# EAGLE design MediumWaveRadioTransmitter (EAGLE 9.6.2)
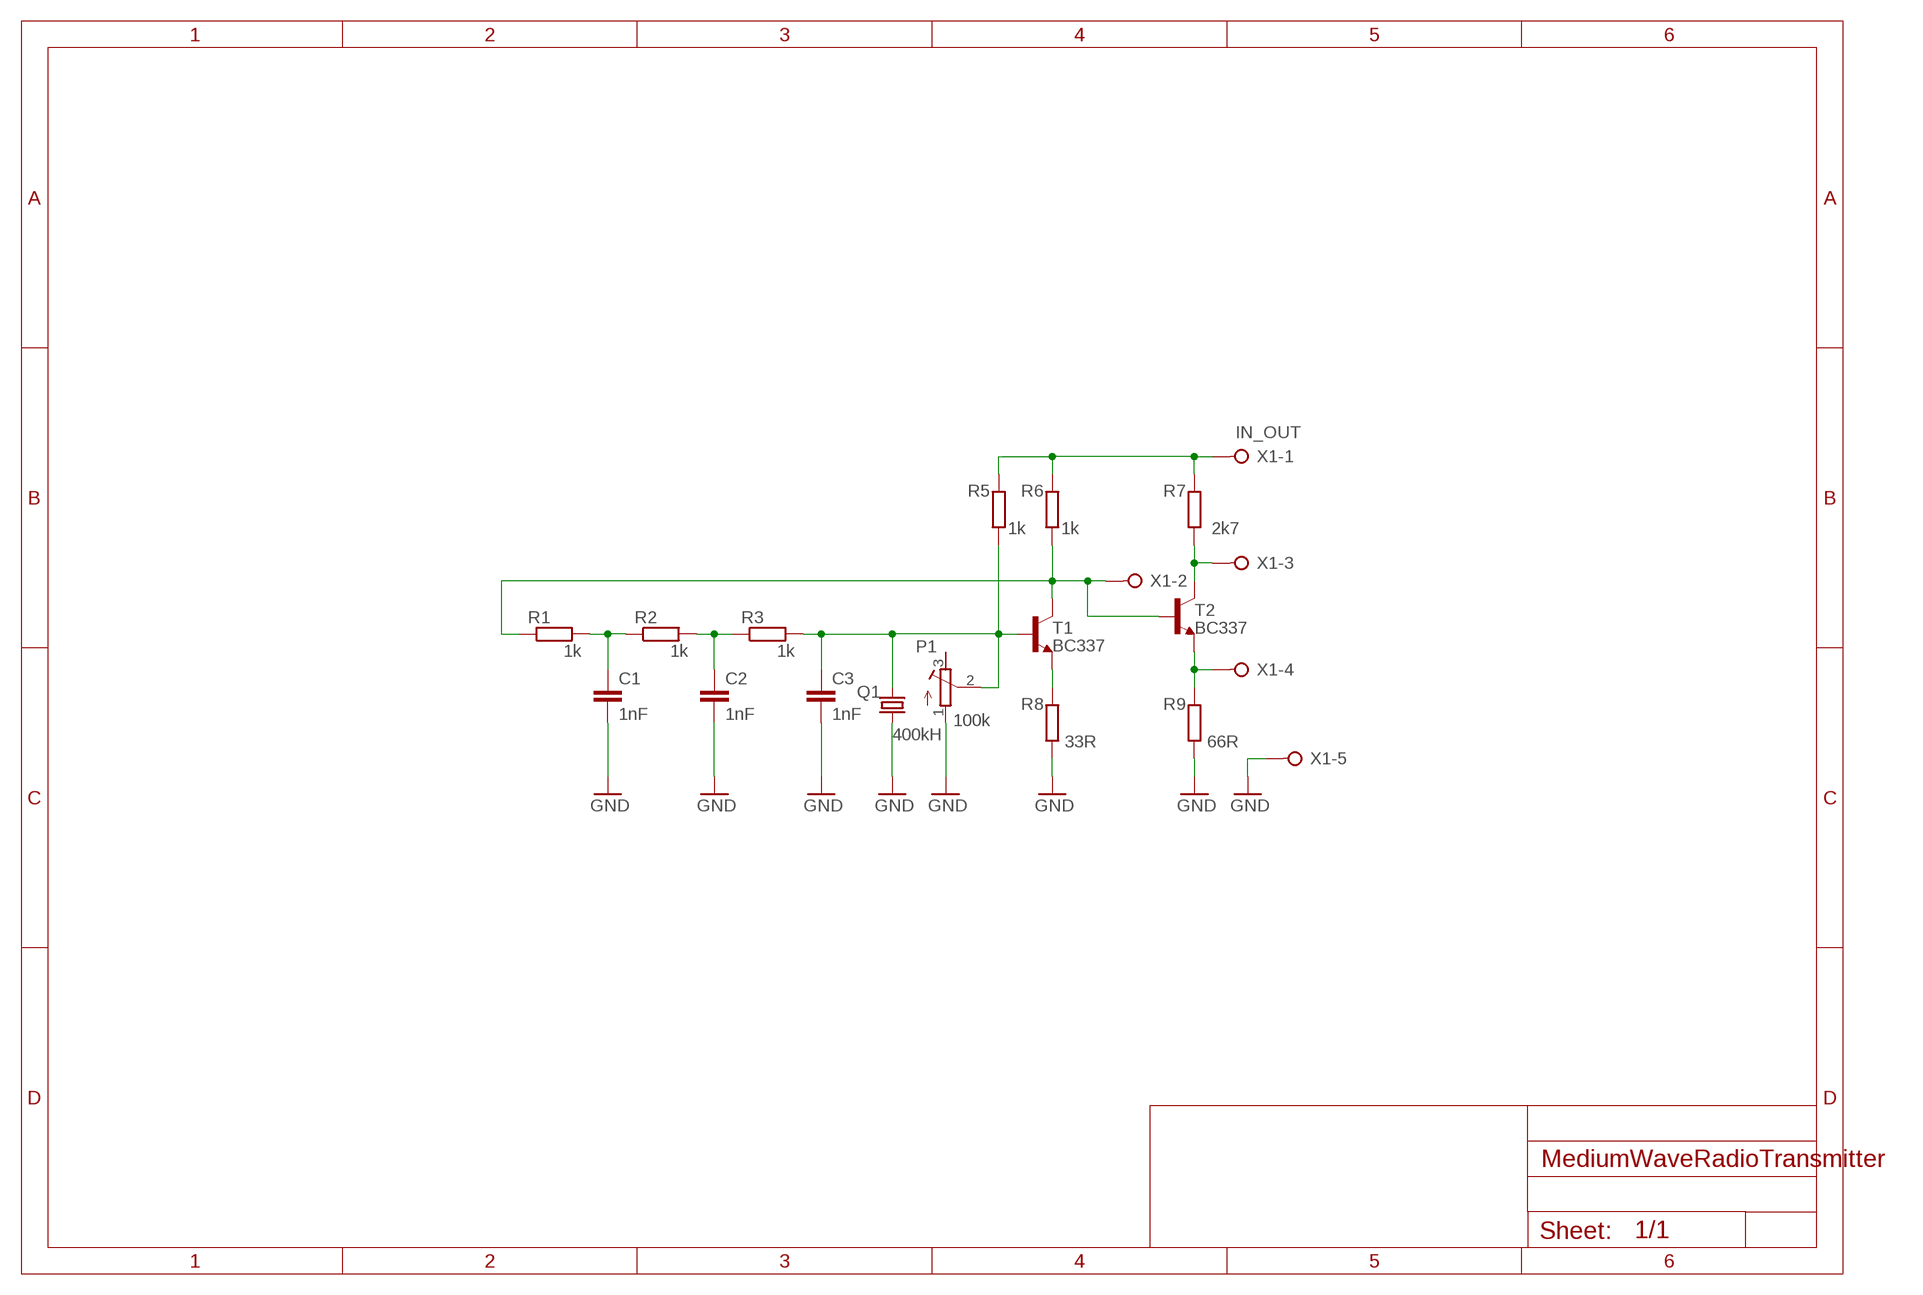
[diagram p0: schematic, sheet 1]

## Parts
C1  1nF  C-EU050-024X044  [C050-024X044]
C2  1nF  C-EU050-024X044  [C050-024X044]
C3  1nF  C-EU050-024X044  [C050-024X044]
P1  100k  R-TRIMM3296W  [RTRIM3296W]
Q1  400kH  CRYSTALHC18U-V  [HC18U-V]
R1  1k  R-EU_0207/10  [0207/10]
R2  1k  R-EU_0207/10  [0207/10]
R3  1k  R-EU_0207/10  [0207/10]
R5  1k  R-EU_0207/10  [0207/10]
R6  1k  R-EU_0207/10  [0207/10]
R7  2k7  R-EU_0207/10  [0207/10]
R8  33R  R-EU_0207/10  [0207/10]
R9  66R  R-EU_0207/10  [0207/10]
T1  BC337  BC337-16-NPN-TO92-CBE  [TO92-CBE]
T2  BC337  BC337-16-NPN-TO92-CBE  [TO92-CBE]
X1  IN_OUT  W237-05P  [W237-5P]

## Nets
GND: C1.2 C2.2 C3.2 P1.1(A) Q1.2 R8.1 R9.1 X1.5
N$1: C1.1 R1.2 R2.1
N$2: C2.1 R2.2 R3.1
N$3: C3.1 P1.2(S) Q1.1 R3.2 R5.1 T1.B
N$5: R1.1 R6.1 T1.C T2.B X1.2
N$6: R8.2 T1.E
N$7: R5.2 R6.2 R7.2 X1.1
N$8: R9.2 T2.E X1.4
N$10: R7.1 T2.C X1.3
Unconnected: P1.3(E)

## Library data of the parts
C1-C3 = rcl:C-EU: CAPACITOR, European symbol; SPICEPREFIX: C
P1 = rcl:R-TRIMM: Trimm resistor; SPICEMODEL: X; SPICEPREFIXL: POT
Q1 = crystal:CRYSTAL: CRYSTAL; OC_FARNELL: unknown; OC_NEWARK: unknown
R1-R3 R5-R9 = rcl:R-EU_: RESISTOR, European symbol; SPICEPREFIX: R
T1 T2 = transistor:*-NPN-: NPN Transistror BF959 corrected 2008.03.06
X1 = con-wago-508:W237-05P: WAGO SREW CLAMP; OC_FARNELL: unknown; OC_NEWARK: unknown

## Board
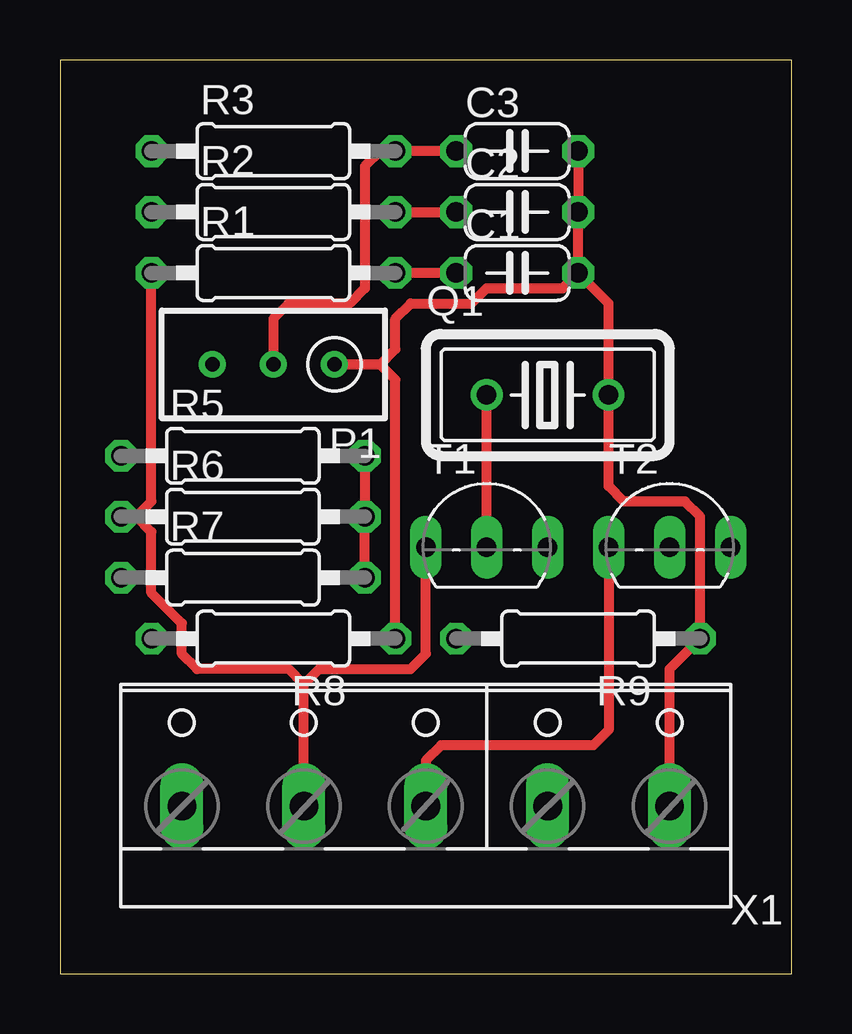
[diagram p1: board, top side]
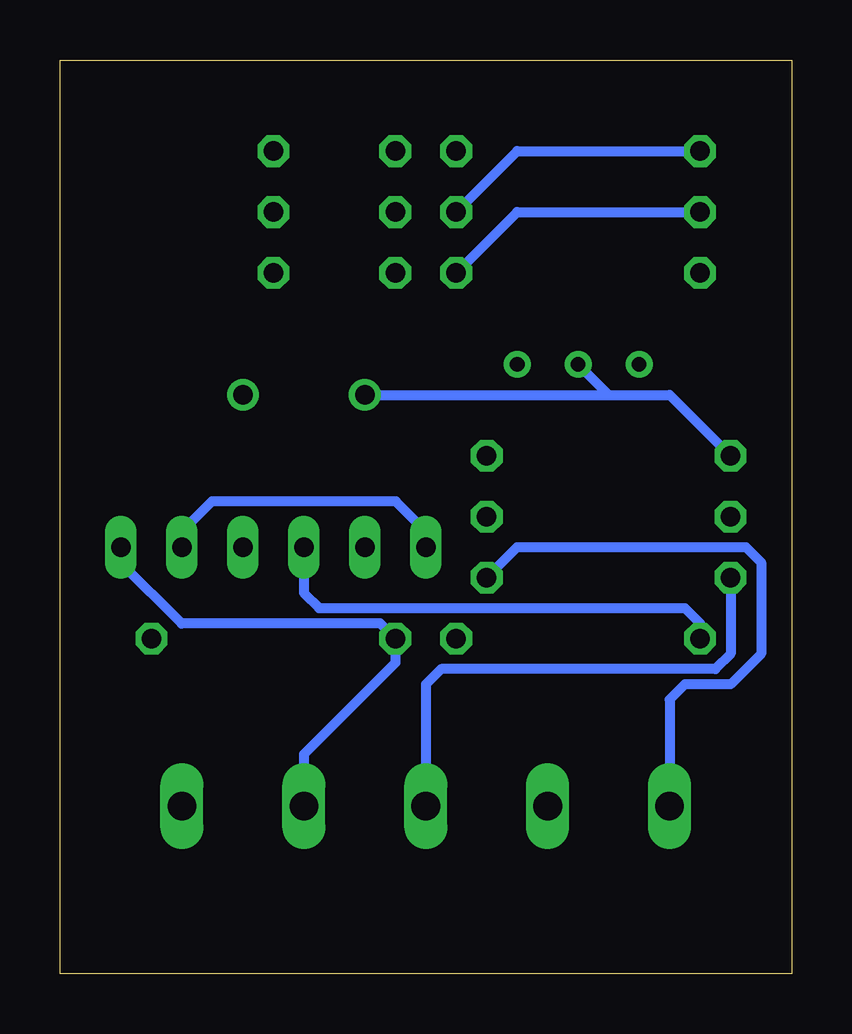
[diagram p2: board, bottom side, seen from below]

Size 30.48 x 38.09 mm. Coordinates in mm from the lower left corner, seen from the top.
Outline: 0,0 30.48,0 30.48,38.09 0,38.09 0,0
Copper layers (1*16): Top 0.035mm / dielectric 1.5mm / Bottom 0.035mm
Design rules "default *": minimum track width 16mil, minimum drill 0.5mm, track to track 6mil, track to pad 6mil, pad to pad 6mil, via to via 6mil, smd to smd 6mil, copper to edge 40mil, drill to drill 6mil, minimum pad ring 10mil, minimum via ring 8mil, stop-mask expansion 4mil, vias tented up to drill 0mil, thermal gap 10mil

### Footprints (pad centres in the part's own frame; a part is rotated, then mirrored left to right if it is on the bottom)
C050-024X044 = drill 0.813 octagon: 1 -2.54,0; 2 2.54,0
RTRIM3296W = drill 0.61: 1 0,-2.54; 2 0,0; 3 0,2.54
HC18U-V = drill 0.813: 1 -2.54,0; 2 2.54,0
0207/10 = drill 0.813 octagon: 1 -5.08,0; 2 5.08,0
TO92-CBE = drill 0.813 long: B 0,0; C -2.54,0; E 2.54,0
W237-5P = drill 1.194 long: 1 -10.16,-0.635; 2 -5.08,-0.635; 3 0,-0.635; 4 5.08,-0.635; 5 10.16,-0.635

### Placement (x,y rotation side)
C1  19.05,29.21 0 top
C2  19.05,31.75 0 top
C3  19.05,34.29 0 top
P1  8.89,25.4 90 top
Q1  20.32,24.13 0 top
R1  8.89,29.21 0 top
R2  8.89,31.75 0 top
R3  8.89,34.29 0 top
R5  7.62,21.59 0 top
R6  7.62,19.05 0 top
R7  7.62,16.51 0 top
R8  8.89,13.97 180 top
R9  21.59,13.97 180 top
T1  17.78,17.78 0 top
T2  25.4,17.78 0 top
X1  15.24,7.62 0 top

### Tracks (layer width: path | path; a pad name or v marks a point on that pad's centre or on a via)
GND
  Top 0.406: C3.2 C2.2 C1.2 | C1.2 22.86,27.94 Q1.2 22.86,20.32 23.5,19.68 26.04,19.68 26.67,19.05 R9.1 25.4,12.7 X1.5 | C1.2 20.95,28.57 17.78,28.57 17.14,27.94 14.61,27.94 13.97,27.3 13.97,26.04 13.34,25.4 | R8.1 13.97,24.77 13.34,25.4 | 13.34,25.4 P1.1
N$1
  Top 0.406: C1.1 R1.2
  Bottom 0.406: R1.2 11.43,31.75 R2.1
N$2
  Top 0.406: R2.2 C2.1
  Bottom 0.406: R2.2 11.43,34.29 R3.1
N$3
  Top 0.406: T1.B Q1.1 | P1.2 8.89,27.3 9.53,27.94 12.06,27.94 12.7,28.57 12.7,33.66 13.34,34.29 R3.2 C3.1
  Bottom 0.406: Q1.1 7.62,24.13 | 7.62,24.13 5.08,24.13 R5.1 | 7.62,24.13 P1.2
N$5
  Top 0.406: X1.2 10.16,12.06 | 10.16,12.06 10.79,12.7 14.61,12.7 15.24,13.34 T1.C | 10.16,12.06 9.53,12.7 5.71,12.7 5.08,13.34 5.08,14.61 3.81,15.88 3.81,18.41 3.17,19.05 | R6.1 3.17,19.05 | 3.17,19.05 3.81,19.68 R1.1
  Bottom 0.406: T1.C 15.24,18.44 16.48,19.68 24.16,19.68 25.4,18.44 T2.B
N$6
  Bottom 0.406: T1.E 20.32,15.88 19.68,15.24 4.45,15.24 3.81,14.61 R8.2
N$7
  Top 0.406: R5.2 R6.2 R7.2
  Bottom 0.406: R7.2 11.43,17.78 1.91,17.78 1.27,17.14 1.27,13.34 2.54,12.06 4.45,12.06 5.08,11.43 X1.1
N$8
  Bottom 0.406: T2.E 27.94,17.12 25.41,14.59 25.4,14.61 17.14,14.61 R9.2 16.51,12.96 20.32,9.15 X1.4
N$10
  Top 0.406: T2.C 22.86,10.16 22.23,9.53 15.88,9.53 15.24,8.89 X1.3
  Bottom 0.406: R7.1 2.54,13.34 3.17,12.7 14.61,12.7 15.24,12.06 X1.3